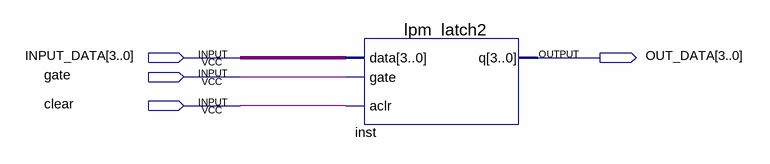
[diagram p0: schematic sheet]
// Quartus schematic test.bdf as structural Verilog: 1 symbols, 4 pins
module test (
  input  [3:0] INPUT_DATA,
  input  gate,
  input  clear,
  output [3:0] OUT_DATA
);

  lpm_latch2 inst (.data(INPUT_DATA), .gate(gate), .aclr(clear), .q(OUT_DATA));
endmodule
